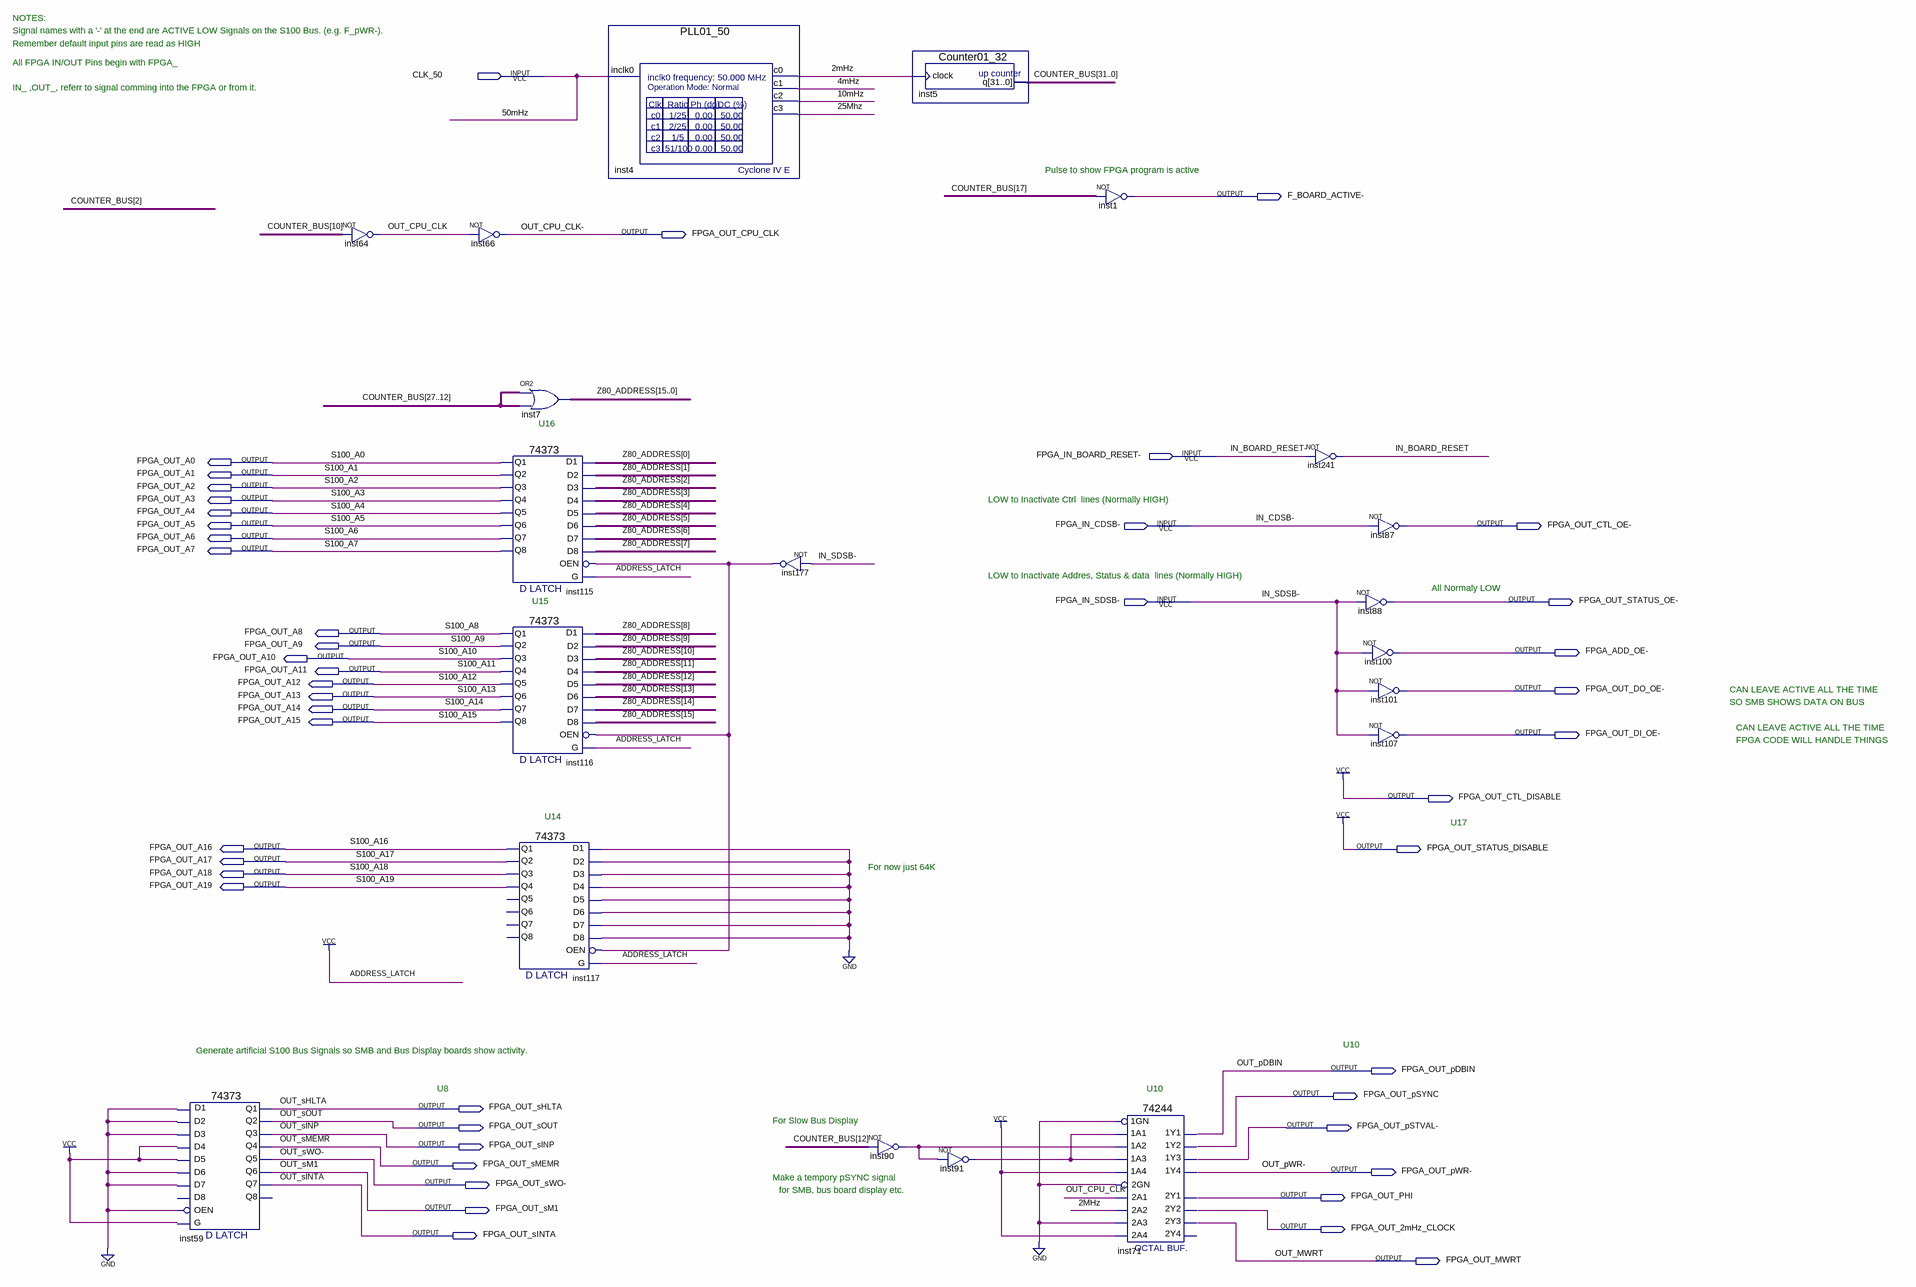
[diagram p0: schematic sheet]
// Quartus schematic Z80_FPGA1 -- (Address Lines Test).bdf as structural Verilog: 20 symbols, 47 pins
module \Z80_FPGA1_--_(Address_Lines_Test)  (
  input  CLK_50,
  input  \FPGA_IN_BOARD_RESET- ,
  input  \FPGA_IN_CDSB- ,
  input  \FPGA_IN_SDSB- ,
  output \F_BOARD_ACTIVE- ,
  output FPGA_OUT_CPU_CLK,
  output FPGA_OUT_A0,
  output FPGA_OUT_A1,
  output FPGA_OUT_A2,
  output FPGA_OUT_A3,
  output FPGA_OUT_A4,
  output FPGA_OUT_A5,
  output \FPGA_OUT_CTL_OE- ,
  output FPGA_OUT_A6,
  output FPGA_OUT_A7,
  output \FPGA_OUT_STATUS_OE- ,
  output FPGA_OUT_A8,
  output FPGA_OUT_A9,
  output \FPGA_ADD_OE- ,
  output FPGA_OUT_A10,
  output FPGA_OUT_A11,
  output FPGA_OUT_A12,
  output \FPGA_OUT_DO_OE- ,
  output FPGA_OUT_A13,
  output FPGA_OUT_A14,
  output FPGA_OUT_A15,
  output \FPGA_OUT_DI_OE- ,
  output FPGA_OUT_CTL_DISABLE,
  output FPGA_OUT_A16,
  output FPGA_OUT_STATUS_DISABLE,
  output FPGA_OUT_A17,
  output FPGA_OUT_A18,
  output FPGA_OUT_A19,
  output FPGA_OUT_pDBIN,
  output FPGA_OUT_pSYNC,
  output FPGA_OUT_sHLTA,
  output FPGA_OUT_sOUT,
  output \FPGA_OUT_pSTVAL- ,
  output FPGA_OUT_sINP,
  output FPGA_OUT_sMEMR,
  output \FPGA_OUT_pWR- ,
  output \FPGA_OUT_sWO- ,
  output FPGA_OUT_PHI,
  output FPGA_OUT_sM1,
  output FPGA_OUT_2mHz_CLOCK,
  output FPGA_OUT_sINTA,
  output FPGA_OUT_MWRT
);

  wire \2mHz , \4mHz , \10mHz , \25Mhz , IN_BOARD_RESET, inst90_out, inst91_out, inst177_out, OUT_CPU_CLK;
  wire [15:0] Z80_ADDRESS;
  wire [31:0] COUNTER_BUS;

  \74373  inst59 (
    .D1(1'b0), .D3(1'b0), .D6(1'b0), .D7(1'b0), .D2(1'b0), .G(1'b1), .D4(1'b1), .D5(1'b1), .OEN(1'b0),
    .Q3(FPGA_OUT_sINP), .Q6(FPGA_OUT_sM1), .Q7(FPGA_OUT_sINTA), .Q2(FPGA_OUT_sOUT), .Q4(FPGA_OUT_sMEMR),
    .Q5(\FPGA_OUT_sWO- ), .Q1(FPGA_OUT_sHLTA));  // open: D8, Q8
  not inst64 (OUT_CPU_CLK, COUNTER_BUS[10]);
  not inst66 (FPGA_OUT_CPU_CLK, OUT_CPU_CLK);
  \74373  inst115 (
    .D1(Z80_ADDRESS[0]), .D3(Z80_ADDRESS[2]), .D6(Z80_ADDRESS[5]), .D7(Z80_ADDRESS[6]), .D2(Z80_ADDRESS[1]),
    .G(1'b1), .D4(Z80_ADDRESS[3]), .D5(Z80_ADDRESS[4]), .D8(Z80_ADDRESS[7]), .OEN(inst177_out),
    .Q3(FPGA_OUT_A2), .Q6(FPGA_OUT_A5), .Q7(FPGA_OUT_A6), .Q2(FPGA_OUT_A1), .Q8(FPGA_OUT_A7),
    .Q4(FPGA_OUT_A3), .Q5(FPGA_OUT_A4), .Q1(FPGA_OUT_A0));
  \74373  inst116 (
    .D1(Z80_ADDRESS[8]), .D3(Z80_ADDRESS[10]), .D6(Z80_ADDRESS[13]), .D7(Z80_ADDRESS[14]),
    .D2(Z80_ADDRESS[9]), .G(1'b1), .D4(Z80_ADDRESS[11]), .D5(Z80_ADDRESS[12]), .D8(Z80_ADDRESS[15]),
    .OEN(inst177_out), .Q3(FPGA_OUT_A10), .Q6(FPGA_OUT_A13), .Q7(FPGA_OUT_A14), .Q2(FPGA_OUT_A9),
    .Q8(FPGA_OUT_A15), .Q4(FPGA_OUT_A11), .Q5(FPGA_OUT_A12), .Q1(FPGA_OUT_A8));
  assign Z80_ADDRESS = COUNTER_BUS[27:12] | COUNTER_BUS[27:12];  // OR2 inst7, 16 bits wide
  \74373  inst117 (
    .D1(1'b0), .D3(1'b0), .D6(1'b0), .D7(1'b0), .D2(1'b0), .G(1'b1), .D4(1'b0), .D5(1'b0), .D8(1'b0),
    .OEN(inst177_out), .Q3(FPGA_OUT_A18), .Q2(FPGA_OUT_A17), .Q4(FPGA_OUT_A19), .Q1(FPGA_OUT_A16));  // open: Q6, Q7, Q8, Q5
  PLL01_50 inst4 (.inclk0(CLK_50), .c0(\2mHz ), .c1(\4mHz ), .c2(\10mHz ), .c3(\25Mhz ));
  not inst177 (inst177_out, \FPGA_IN_SDSB- );
  not inst90 (inst90_out, COUNTER_BUS[12]);
  Counter01_32 inst5 (.clock(\2mHz ), .q(COUNTER_BUS));
  not inst91 (inst91_out, inst90_out);
  not inst1 (\F_BOARD_ACTIVE- , COUNTER_BUS[17]);
  \74244  inst71 (
    .\1A2 (inst90_out), .\1A4 (1'b1), .\1A1 (inst91_out), .\1A3 (inst91_out), .\1GN (1'b0), .\2A3 (1'b0),
    .\2GN (1'b0), .\2A1 (OUT_CPU_CLK), .\2A4 (1'b1), .\2A2 (\2mHz ), .\1Y2 (FPGA_OUT_pSYNC),
    .\1Y4 (\FPGA_OUT_pWR- ), .\2Y1 (FPGA_OUT_PHI), .\1Y1 (FPGA_OUT_pDBIN), .\2Y3 (FPGA_OUT_MWRT),
    .\1Y3 (\FPGA_OUT_pSTVAL- ), .\2Y2 (FPGA_OUT_2mHz_CLOCK));  // open: 2Y4
  not inst241 (IN_BOARD_RESET, \FPGA_IN_BOARD_RESET- );
  not inst88 (\FPGA_OUT_STATUS_OE- , \FPGA_IN_SDSB- );
  not inst100 (\FPGA_ADD_OE- , \FPGA_IN_SDSB- );
  not inst87 (\FPGA_OUT_CTL_OE- , \FPGA_IN_CDSB- );
  not inst101 (\FPGA_OUT_DO_OE- , \FPGA_IN_SDSB- );
  not inst107 (\FPGA_OUT_DI_OE- , \FPGA_IN_SDSB- );

  assign FPGA_OUT_CTL_DISABLE = 1'b1;
  assign FPGA_OUT_STATUS_DISABLE = 1'b1;

  // Other names for the same wires on the sheet: 50mHz = CLK_50; OUT_sINP = FPGA_OUT_sINP; OUT_sINTA = FPGA_OUT_sINTA;
  //   OUT_sM1 = FPGA_OUT_sM1; OUT_sMEMR = FPGA_OUT_sMEMR; OUT_sOUT = FPGA_OUT_sOUT; OUT_sWO- = \FPGA_OUT_sWO- ;
  //   IN_BOARD_RESET- = \FPGA_IN_BOARD_RESET- ; IN_CDSB- = \FPGA_IN_CDSB- ; IN_SDSB- = \FPGA_IN_SDSB- ;
  //   OUT_CPU_CLK- = FPGA_OUT_CPU_CLK; OUT_MWRT = FPGA_OUT_MWRT; OUT_pDBIN = FPGA_OUT_pDBIN;
  //   OUT_pWR- = \FPGA_OUT_pWR- ; OUT_sHLTA = FPGA_OUT_sHLTA; S100_A0 = FPGA_OUT_A0; S100_A1 = FPGA_OUT_A1;
  //   S100_A2 = FPGA_OUT_A2; S100_A3 = FPGA_OUT_A3; S100_A4 = FPGA_OUT_A4; S100_A5 = FPGA_OUT_A5;
  //   S100_A6 = FPGA_OUT_A6; S100_A7 = FPGA_OUT_A7; S100_A8 = FPGA_OUT_A8; S100_A9 = FPGA_OUT_A9;
  //   S100_A10 = FPGA_OUT_A10; S100_A11 = FPGA_OUT_A11; S100_A12 = FPGA_OUT_A12; S100_A13 = FPGA_OUT_A13;
  //   S100_A14 = FPGA_OUT_A14; S100_A15 = FPGA_OUT_A15; S100_A16 = FPGA_OUT_A16; S100_A17 = FPGA_OUT_A17;
  //   S100_A18 = FPGA_OUT_A18; S100_A19 = FPGA_OUT_A19

  // Notes on the sheet:
  //   NOTES:
  //   Signal names with a '-' at the end are ACTIVE LOW Signals on the S100 Bus. (e.g. F_pWR-).
  //   Remember default input pins are read as HIGH
  //   All FPGA IN/OUT Pins begin with FPGA_
  //   IN_ ,OUT_, referr to signal comming into the FPGA or from it.
  //   Pulse to show FPGA program is active
  //   U16
  //   LOW to Inactivate Ctrl  lines (Normally HIGH)
  //   LOW to Inactivate Addres, Status & data  lines (Normally HIGH)
  //   All Normaly LOW
  //   U15
  //   CAN LEAVE ACTIVE ALL THE TIME
  //   SO SMB SHOWS DATA ON BUS
  //   CAN LEAVE ACTIVE ALL THE TIME
  //   FPGA CODE WILL HANDLE THINGS
  //   U14
  //   U17
  //   For now just 64K
  //   U10
  //   Generate artificial S100 Bus Signals so SMB and Bus Display boards show activity. 
  //   U8
  //   U10
  //   For Slow Bus Display
  //   Make a tempory pSYNC signal 
  //   for SMB, bus board display etc.
endmodule
